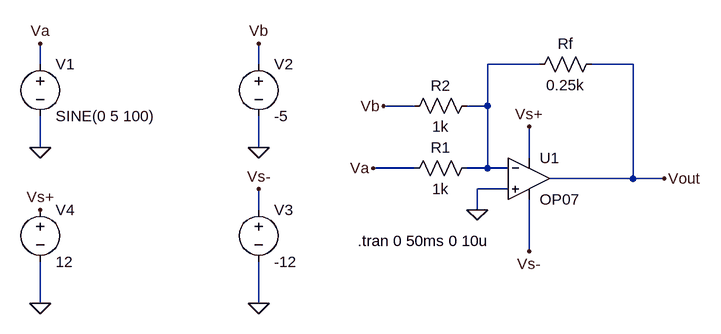
[diagram p0: schematic Inverting Summing Amp.asc]
Inverting Summing Amp.asc, the LTspice schematic file:
Version 4
SHEET 1 1096 680
WIRE 64 48 64 16
WIRE 400 48 400 16
WIRE 832 48 752 48
WIRE 976 48 912 48
WIRE 640 112 592 112
WIRE 752 112 752 48
WIRE 752 112 720 112
WIRE 64 176 64 128
WIRE 400 176 400 128
WIRE 816 192 816 144
WIRE 640 208 576 208
WIRE 752 208 752 112
WIRE 752 208 720 208
WIRE 784 208 752 208
WIRE 976 224 976 48
WIRE 976 224 848 224
WIRE 1024 224 976 224
WIRE 784 240 736 240
WIRE 400 272 400 240
WIRE 736 272 736 240
WIRE 816 336 816 256
WIRE 64 416 64 352
WIRE 400 416 400 352
FLAG 64 176 0
FLAG 400 176 0
FLAG 64 416 0
FLAG 400 416 0
FLAG 736 272 0
FLAG 64 16 Va
FLAG 576 208 Va
FLAG 400 16 Vb
FLAG 592 112 Vb
FLAG 64 272 Vs+
FLAG 816 144 Vs+
FLAG 400 240 Vs-
FLAG 816 336 Vs-
FLAG 1024 224 Vout
SYMBOL voltage 64 32 R0
WINDOW 123 0 0 Left 0
WINDOW 39 0 0 Left 0
SYMATTR InstName V1
SYMATTR Value SINE(0 5 100)
SYMBOL voltage 400 32 R0
SYMATTR InstName V2
SYMATTR Value -5
SYMBOL voltage 400 256 R0
SYMATTR InstName V3
SYMATTR Value -12
SYMBOL voltage 64 256 R0
SYMATTR InstName V4
SYMATTR Value 12
SYMBOL OpAmps\\OP07 816 160 R0
SYMATTR InstName U1
SYMBOL res 736 192 R90
WINDOW 0 0 56 VBottom 2
WINDOW 3 32 56 VTop 2
SYMATTR InstName R1
SYMATTR Value 1k
SYMBOL res 736 96 R90
WINDOW 0 0 56 VBottom 2
WINDOW 3 32 56 VTop 2
SYMATTR InstName R2
SYMATTR Value 1k
SYMBOL res 928 32 R90
WINDOW 0 0 56 VBottom 2
WINDOW 3 32 56 VTop 2
SYMATTR InstName Rf
SYMATTR Value 0.25k
TEXT 552 320 Left 2 !.tran 0 50ms 0 10u

The netlist it stands for:
* Inverting Summing Amp.asc
V1 Va 0 SINE(0 5 100)
V2 Vb 0 -5
V3 Vs- 0 -12
V4 Vs+ 0 12
XU1 0 N001 Vs+ Vs- Vout LT1001  ; OP07, pins In+ In- V+ V- OUT
R1 N001 Va 1k
R2 N001 Vb 1k
Rf Vout N001 0.25k
.tran 0 50ms 0 10u
.lib LTC.lib
.backanno
.end